# Altium schematic sheet Opto_Circuits.SchDoc
size A
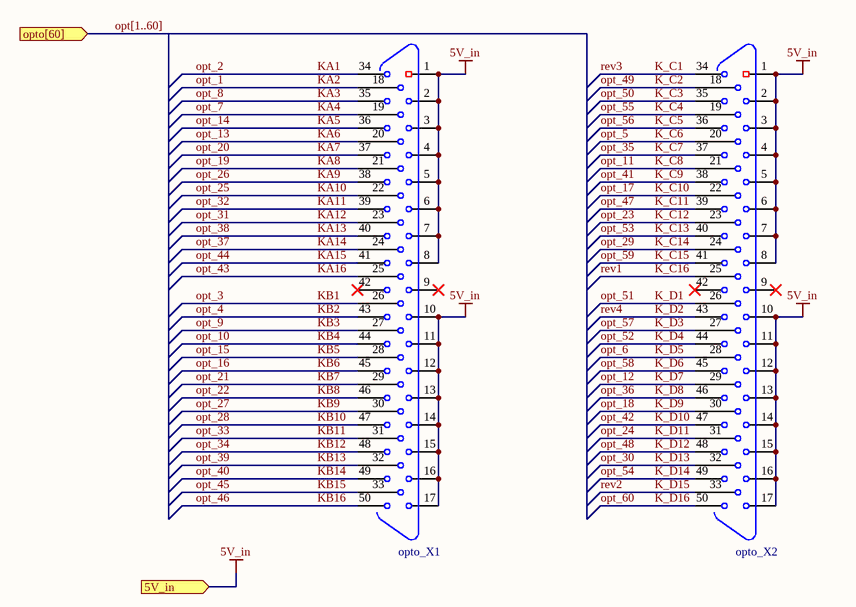
[diagram p0: Opto_Circuits.SchDoc]

## Parts
opto_X1  DB50  [DB50_RA]  (value not drawn)
opto_X2  DB50  [DB50_RA]  (value not drawn)

## Ports
5V_in (in), opto[60] (in)

## Nets
5V_in: opto_X1.1 opto_X1.2 opto_X1.3 opto_X1.4 opto_X1.5 opto_X1.6 opto_X1.7 opto_X1.8 opto_X1.10 opto_X1.11 opto_X1.12 opto_X1.13 opto_X1.14 opto_X1.15 opto_X1.16 opto_X1.17 opto_X2.1 opto_X2.2 opto_X2.3 opto_X2.4 opto_X2.5 opto_X2.6 opto_X2.7 opto_X2.8 opto_X2.10 opto_X2.11 opto_X2.12 opto_X2.13 opto_X2.14 opto_X2.15 opto_X2.16 opto_X2.17 ; port 5V_in
K_C1: opto_X2.34  [also labelled rev3]
K_C2: opto_X2.18  [also labelled opt_49]
K_C3: opto_X2.35  [also labelled opt_50]
K_C4: opto_X2.19  [also labelled opt_55]
K_C5: opto_X2.36  [also labelled opt_56]
K_C6: opto_X2.20  [also labelled opt_5]
K_C7: opto_X2.37  [also labelled opt_35]
K_C8: opto_X2.21  [also labelled opt_11]
K_C9: opto_X2.38  [also labelled opt_41]
K_C10: opto_X2.22  [also labelled opt_17]
K_C11: opto_X2.39  [also labelled opt_47]
K_C12: opto_X2.23  [also labelled opt_23]
K_C13: opto_X2.40  [also labelled opt_53]
K_C14: opto_X2.24  [also labelled opt_29]
K_C15: opto_X2.41  [also labelled opt_59]
K_C16: opto_X2.25  [also labelled rev1]
K_D1: opto_X2.26  [also labelled opt_51]
K_D2: opto_X2.43  [also labelled rev4]
K_D3: opto_X2.27  [also labelled opt_57]
K_D4: opto_X2.44  [also labelled opt_52]
K_D5: opto_X2.28  [also labelled opt_6]
K_D6: opto_X2.45  [also labelled opt_58]
K_D7: opto_X2.29  [also labelled opt_12]
K_D8: opto_X2.46  [also labelled opt_36]
K_D9: opto_X2.30  [also labelled opt_18]
K_D10: opto_X2.47  [also labelled opt_42]
K_D11: opto_X2.31  [also labelled opt_24]
K_D12: opto_X2.48  [also labelled opt_48]
K_D13: opto_X2.32  [also labelled opt_30]
K_D14: opto_X2.49  [also labelled opt_54]
K_D15: opto_X2.33  [also labelled rev2]
K_D16: opto_X2.50  [also labelled opt_60]
KA1: opto_X1.34  [also labelled opt_2]
KA2: opto_X1.18  [also labelled opt_1]
KA3: opto_X1.35  [also labelled opt_8]
KA4: opto_X1.19  [also labelled opt_7]
KA5: opto_X1.36  [also labelled opt_14]
KA6: opto_X1.20  [also labelled opt_13]
KA7: opto_X1.37  [also labelled opt_20]
KA8: opto_X1.21  [also labelled opt_19]
KA9: opto_X1.38  [also labelled opt_26]
KA10: opto_X1.22  [also labelled opt_25]
KA11: opto_X1.39  [also labelled opt_32]
KA12: opto_X1.23  [also labelled opt_31]
KA13: opto_X1.40  [also labelled opt_38]
KA14: opto_X1.24  [also labelled opt_37]
KA15: opto_X1.41  [also labelled opt_44]
KA16: opto_X1.25  [also labelled opt_43]
KB1: opto_X1.26  [also labelled opt_3]
KB2: opto_X1.43  [also labelled opt_4]
KB3: opto_X1.27  [also labelled opt_9]
KB4: opto_X1.44  [also labelled opt_10]
KB5: opto_X1.28  [also labelled opt_15]
KB6: opto_X1.45  [also labelled opt_16]
KB7: opto_X1.29  [also labelled opt_21]
KB8: opto_X1.46  [also labelled opt_22]
KB9: opto_X1.30  [also labelled opt_27]
KB10: opto_X1.47  [also labelled opt_28]
KB11: opto_X1.31  [also labelled opt_33]
KB12: opto_X1.48  [also labelled opt_34]
KB13: opto_X1.32  [also labelled opt_39]
KB14: opto_X1.49  [also labelled opt_40]
KB15: opto_X1.33  [also labelled opt_45]
KB16: opto_X1.50  [also labelled opt_46]

Not connected (* = marked no-connect by the designer): opto_X1 9(4)* 42*; opto_X2 9(4)* 42*

## Buses and harness runs
bus opt[1..60] = port opto[60]